# EasyEDA schematic BT.json
TITLE: Flarm to WLAN/BT; REV: 1.0; Date: 2023-02-07; Sheet: 1/1; Drawn By: Markus Brunner; Company: Markus Brunner
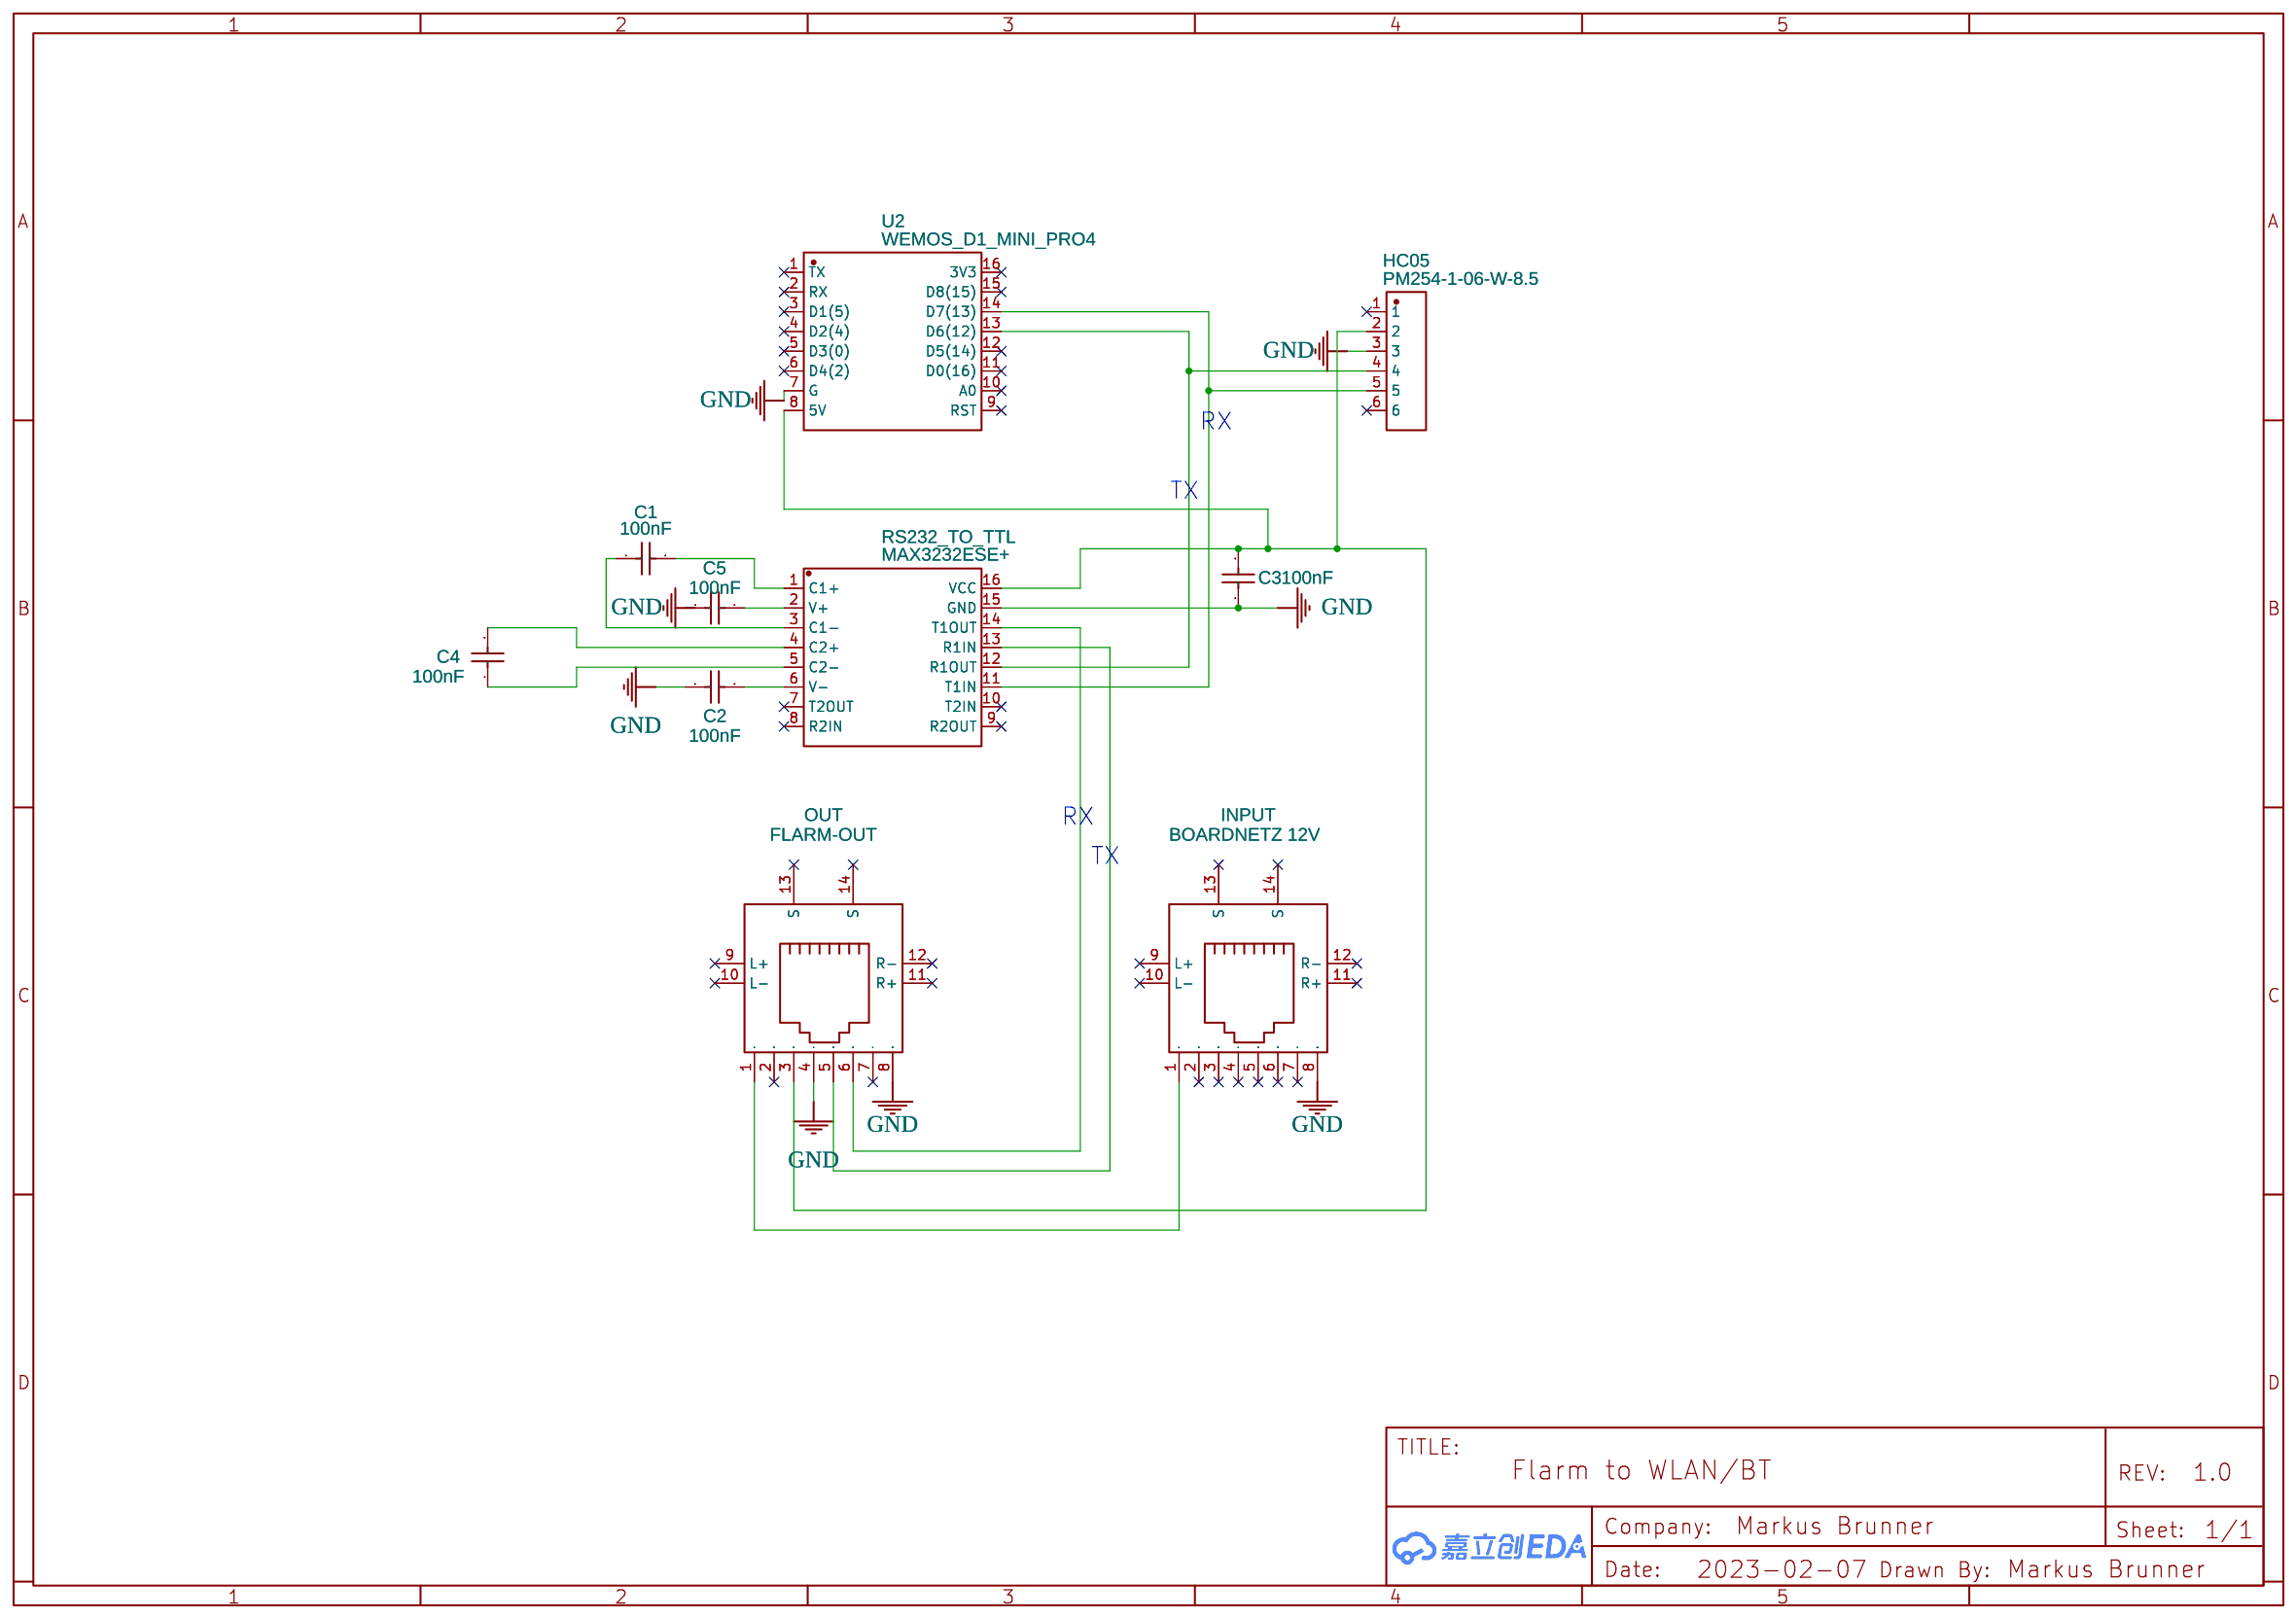
[diagram p0: schematic sheet]

## Parts
C1  100nF  [C0402_NEW]
C2  100nF  [C0402_NEW]
C3  100nF  [C0402_NEW]
C4  100nF  [C0402_NEW]
C5  100nF  [C0402_NEW]
HC05  PM254-1-06-W-8.5  [HDR-TH_6P-P2.54-H-F-W10.0-N]
INPUT  BOARDNETZ 12V  [RJ45-TH_R-RJ45R08P-C000]
OUT  FLARM-OUT  [RJ45-TH_R-RJ45R08P-C000]
RS232_TO_TTL  MAX3232ESE+  [SOIC-16_L9.9-W3.9-P1.27-LS6.0-BL]
U2  WEMOS_D1_MINI_PRO4  [DIP-16_WEMOS_D1_MINI_PRO4]

## Library data of the parts
C1-C5 = CL05B104KO5NNNC: Supplier: LCSC; Manufacturer: SAMSUNG(三星); Supplier Part: C1525; JLCPCB Part Class: Basic Part
HC05 = PM254-1-06-W-8.5: Supplier: LCSC; Supplier Part: C2897388; Manufacturer: HCTL(华灿天禄); Contributor: LCSC; JLCPCB Part Class: Extended Part
INPUT OUT = R-RJ45R08P-C000: Supplier: LCSC; Supplier Part: C386757; Manufacturer: Ckmtw(灿科盟); Contributor: LCSC; JLCPCB Part Class: Extended Part
RS232_TO_TTL = MAX3232ESE+: Supplier: LCSC; Supplier Part: C143435; Manufacturer: MAXIM(美信); Contributor: LCSC; JLCPCB Part Class: Extended Part
U2 = WEMOS_D1_MINI_PRO4: Supplier: LCSC; Supplier Part: C2837266; Manufacturer: null; Manufacturer Part: Wemos_D1_mini_Pro4; Contributor: LCSC; JLCPCB Part Class: Extended Part

## Nets
GND: C2.1 C3.1 C5.1 HC05.3 INPUT.8 OUT.4 OUT.8 RS232_TO_TTL.15(GND) U2.7(G)
Net-(C1-1): C1.1 RS232_TO_TTL.3(C1-)
Net-(C1-2): C1.2 RS232_TO_TTL.1(C1+)
Net-(C2-2): C2.2 RS232_TO_TTL.6(V-)
Net-(C3-2): C3.2 HC05.2 OUT.3 RS232_TO_TTL.16(VCC) U2.8(5V)
Net-(C4-1): C4.1 RS232_TO_TTL.5(C2-)
Net-(C4-2): C4.2 RS232_TO_TTL.4(C2+)
Net-(C5-2): C5.2 RS232_TO_TTL.2(V+)
Net-(HC05-4): HC05.4 RS232_TO_TTL.12(R1OUT) U2.13(D6(12))
Net-(HC05-5): HC05.5 RS232_TO_TTL.11(T1IN) U2.14(D7(13))
Net-(INPUT-1): INPUT.1 OUT.1
Net-(OUT-5): OUT.5 RS232_TO_TTL.13(R1IN)
Net-(OUT-6): OUT.6 RS232_TO_TTL.14(T1OUT)

Not connected (* = marked no-connect by the designer): HC05 1* 6*; INPUT 2* 3* 4* 5* 6* 7* 9(L+)* 10(L-)* 11(R+)* 12(R-)* 13(S)* 14(S)*; OUT 2* 7* 9(L+)* 10(L-)* 11(R+)* 12(R-)* 13(S)* 14(S)*; RS232_TO_TTL 7(T2OUT)* 8(R2IN)* 9(R2OUT)* 10(T2IN)*; U2 1(TX)* 2(RX)* 3(D1(5))* 4(D2(4))* 5(D3(0))* 6(D4(2))* 9(RST)* 10(A0)* 11(D0(16))* 12(D5(14))* 15(D8(15))* 16(3V3)*

## Notes on the sheet
- RX
- TX
- RX
- TX
